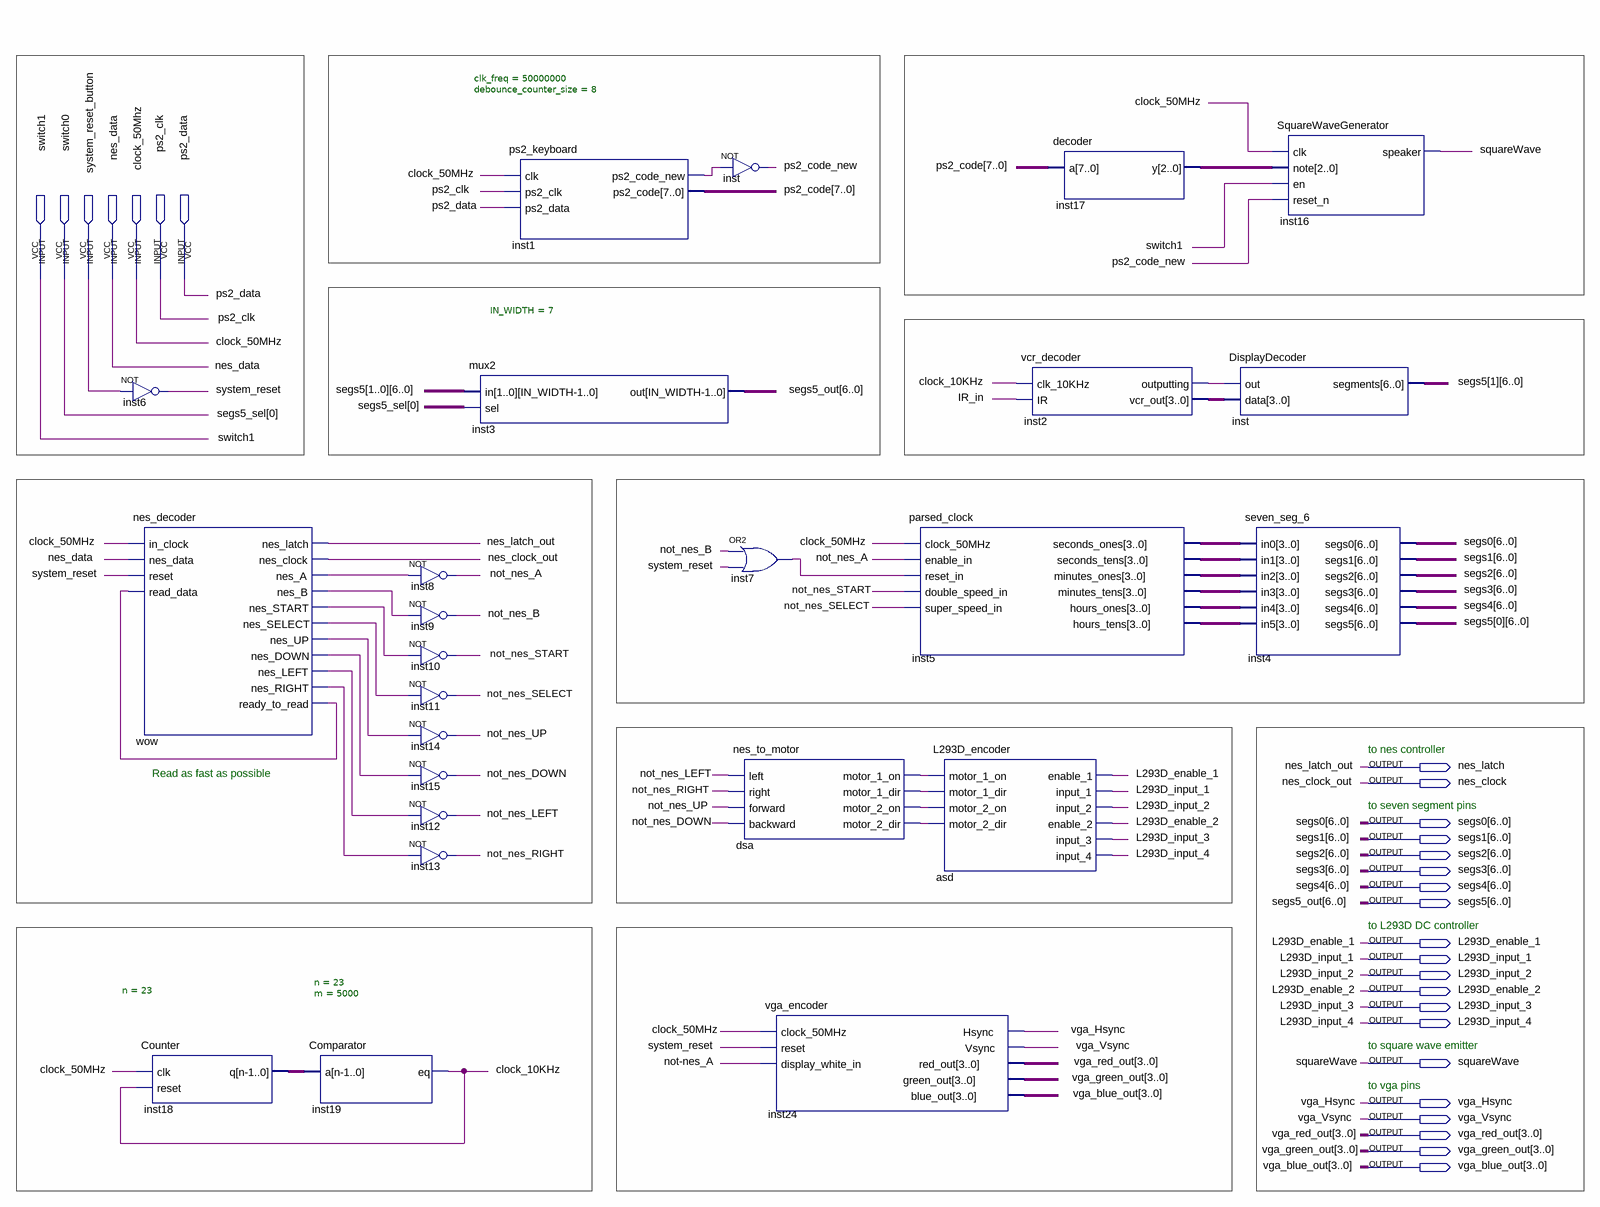
[diagram p0: schematic sheet]
// Quartus schematic top_level.bdf as structural Verilog: 25 symbols, 27 pins
module top_level (
  input  switch1,
  input  switch0,
  input  system_reset_button,
  input  nes_data,
  input  clock_50Mhz,
  input  ps2_clk,
  input  ps2_data,
  output nes_latch,
  output nes_clock,
  output [6:0] segs0,
  output [6:0] segs1,
  output [6:0] segs2,
  output [6:0] segs3,
  output [6:0] segs4,
  output [6:0] segs5,
  output L293D_enable_1,
  output L293D_input_1,
  output L293D_input_2,
  output L293D_enable_2,
  output L293D_input_3,
  output L293D_input_4,
  output squareWave,
  output vga_Hsync,
  output vga_Vsync,
  output [3:0] vga_red_out,
  output [3:0] vga_green_out,
  output [3:0] vga_blue_out
);

  wire clock_10KHz, dsa_motor_1_dir, dsa_motor_1_on, dsa_motor_2_dir, dsa_motor_2_on, inst1_ps2_code_new,
       inst2_outputting, inst7_out, IR_in, \not-nes_A , not_nes_A, not_nes_B, not_nes_DOWN, not_nes_LEFT,
       not_nes_RIGHT, not_nes_SELECT, not_nes_START, not_nes_UP, ps2_code_new, system_reset, wow_nes_a,
       wow_nes_b, wow_nes_down, wow_nes_left, wow_nes_right, wow_nes_select, wow_nes_start, wow_nes_up,
       wow_ready_to_read;
  wire [2:0] inst17_y;
  wire [3:0] inst2_vcr_out, inst5_hours_ones, inst5_hours_tens, inst5_minutes_ones, inst5_minutes_tens,
       inst5_seconds_ones, inst5_seconds_tens;
  wire [6:0] segs5_0, segs5_1;
  wire [7:0] ps2_code;
  wire [22:0] inst18_q;

  not inst6 (system_reset, system_reset_button);
  nes_decoder wow (
    .nes_data(nes_data), .in_clock(clock_50Mhz), .read_data(wow_ready_to_read), .reset(system_reset),
    .nes_latch(nes_latch), .nes_clock(nes_clock), .nes_A(wow_nes_a), .nes_B(wow_nes_b),
    .nes_START(wow_nes_start), .nes_SELECT(wow_nes_select), .nes_UP(wow_nes_up), .nes_DOWN(wow_nes_down),
    .nes_LEFT(wow_nes_left), .nes_RIGHT(wow_nes_right), .ready_to_read(wow_ready_to_read));
  Counter #(.n(23)) inst18 (.clk(clock_50Mhz), .reset(clock_10KHz), .q(inst18_q));
  Comparator #(.n(23), .m(5000)) inst19 (.a(inst18_q), .eq(clock_10KHz));
  not inst8 (not_nes_A, wow_nes_a);
  not inst9 (not_nes_B, wow_nes_b);
  not inst10 (not_nes_START, wow_nes_start);
  not inst11 (not_nes_SELECT, wow_nes_select);
  not inst14 (not_nes_UP, wow_nes_up);
  not inst15 (not_nes_DOWN, wow_nes_down);
  not inst12 (not_nes_LEFT, wow_nes_left);
  not inst13 (not_nes_RIGHT, wow_nes_right);
  mux2 #(.IN_WIDTH(7)) inst3 (.in({segs5_1, segs5_0}), .sel(switch0), .out(segs5));
  ps2_keyboard #(.clk_freq(50000000), .debounce_counter_size(8)) inst1 (
    .clk(clock_50Mhz), .ps2_clk(ps2_clk), .ps2_data(ps2_data), .ps2_code_new(inst1_ps2_code_new),
    .ps2_code(ps2_code));
  not inst (ps2_code_new, inst1_ps2_code_new);
  or inst7 (inst7_out, not_nes_B, system_reset);
  nes_to_motor dsa (
    .left(not_nes_LEFT), .right(not_nes_RIGHT), .forward(not_nes_UP), .backward(not_nes_DOWN),
    .motor_1_on(dsa_motor_1_on), .motor_1_dir(dsa_motor_1_dir), .motor_2_on(dsa_motor_2_on),
    .motor_2_dir(dsa_motor_2_dir));
  vga_encoder inst24 (
    .clock_50MHz(clock_50Mhz), .reset(system_reset), .display_white_in(\not-nes_A ), .Hsync(vga_Hsync),
    .Vsync(vga_Vsync), .red_out(vga_red_out), .green_out(vga_green_out), .blue_out(vga_blue_out));
  parsed_clock inst5 (
    .clock_50MHz(clock_50Mhz), .enable_in(not_nes_A), .reset_in(inst7_out), .double_speed_in(not_nes_START),
    .super_speed_in(not_nes_SELECT), .seconds_ones(inst5_seconds_ones), .seconds_tens(inst5_seconds_tens),
    .minutes_ones(inst5_minutes_ones), .minutes_tens(inst5_minutes_tens), .hours_ones(inst5_hours_ones),
    .hours_tens(inst5_hours_tens));
  L293D_encoder asd (
    .motor_1_on(dsa_motor_1_on), .motor_1_dir(dsa_motor_1_dir), .motor_2_on(dsa_motor_2_on),
    .motor_2_dir(dsa_motor_2_dir), .enable_1(L293D_enable_1), .input_1(L293D_input_1),
    .input_2(L293D_input_2), .enable_2(L293D_enable_2), .input_3(L293D_input_3), .input_4(L293D_input_4));
  decoder inst17 (.a(ps2_code), .y(inst17_y));
  vcr_decoder inst2 (.clk_10KHz(clock_10KHz), .IR(IR_in), .outputting(inst2_outputting), .vcr_out(inst2_vcr_out));
  DisplayDecoder inst_dup2 (.data(inst2_vcr_out), .out(inst2_outputting), .segments(segs5_1));
  seven_seg_6 inst4 (
    .in0(inst5_seconds_ones), .in1(inst5_seconds_tens), .in2(inst5_minutes_ones), .in3(inst5_minutes_tens),
    .in4(inst5_hours_ones), .in5(inst5_hours_tens), .segs0(segs0), .segs1(segs1), .segs2(segs2),
    .segs3(segs3), .segs4(segs4), .segs5(segs5_0));
  SquareWaveGenerator inst16 (
    .clk(clock_50Mhz), .note(inst17_y), .en(switch1), .reset_n(ps2_code_new), .speaker(squareWave));

  // Other names for the same wires on the sheet: nes_clock_out = nes_clock; nes_latch_out = nes_latch;
  //   segs5_out[6:0] = segs5; segs5_sel[0] = switch0

  // Notes on the sheet:
  //   to nes controller
  //   Read as fast as possible
  //   to seven segment pins
  //   to L293D DC controller
  //   to square wave emitter
  //   to vga pins
endmodule
